# Altium schematic sheet LED_PCB.SchDoc
size A3
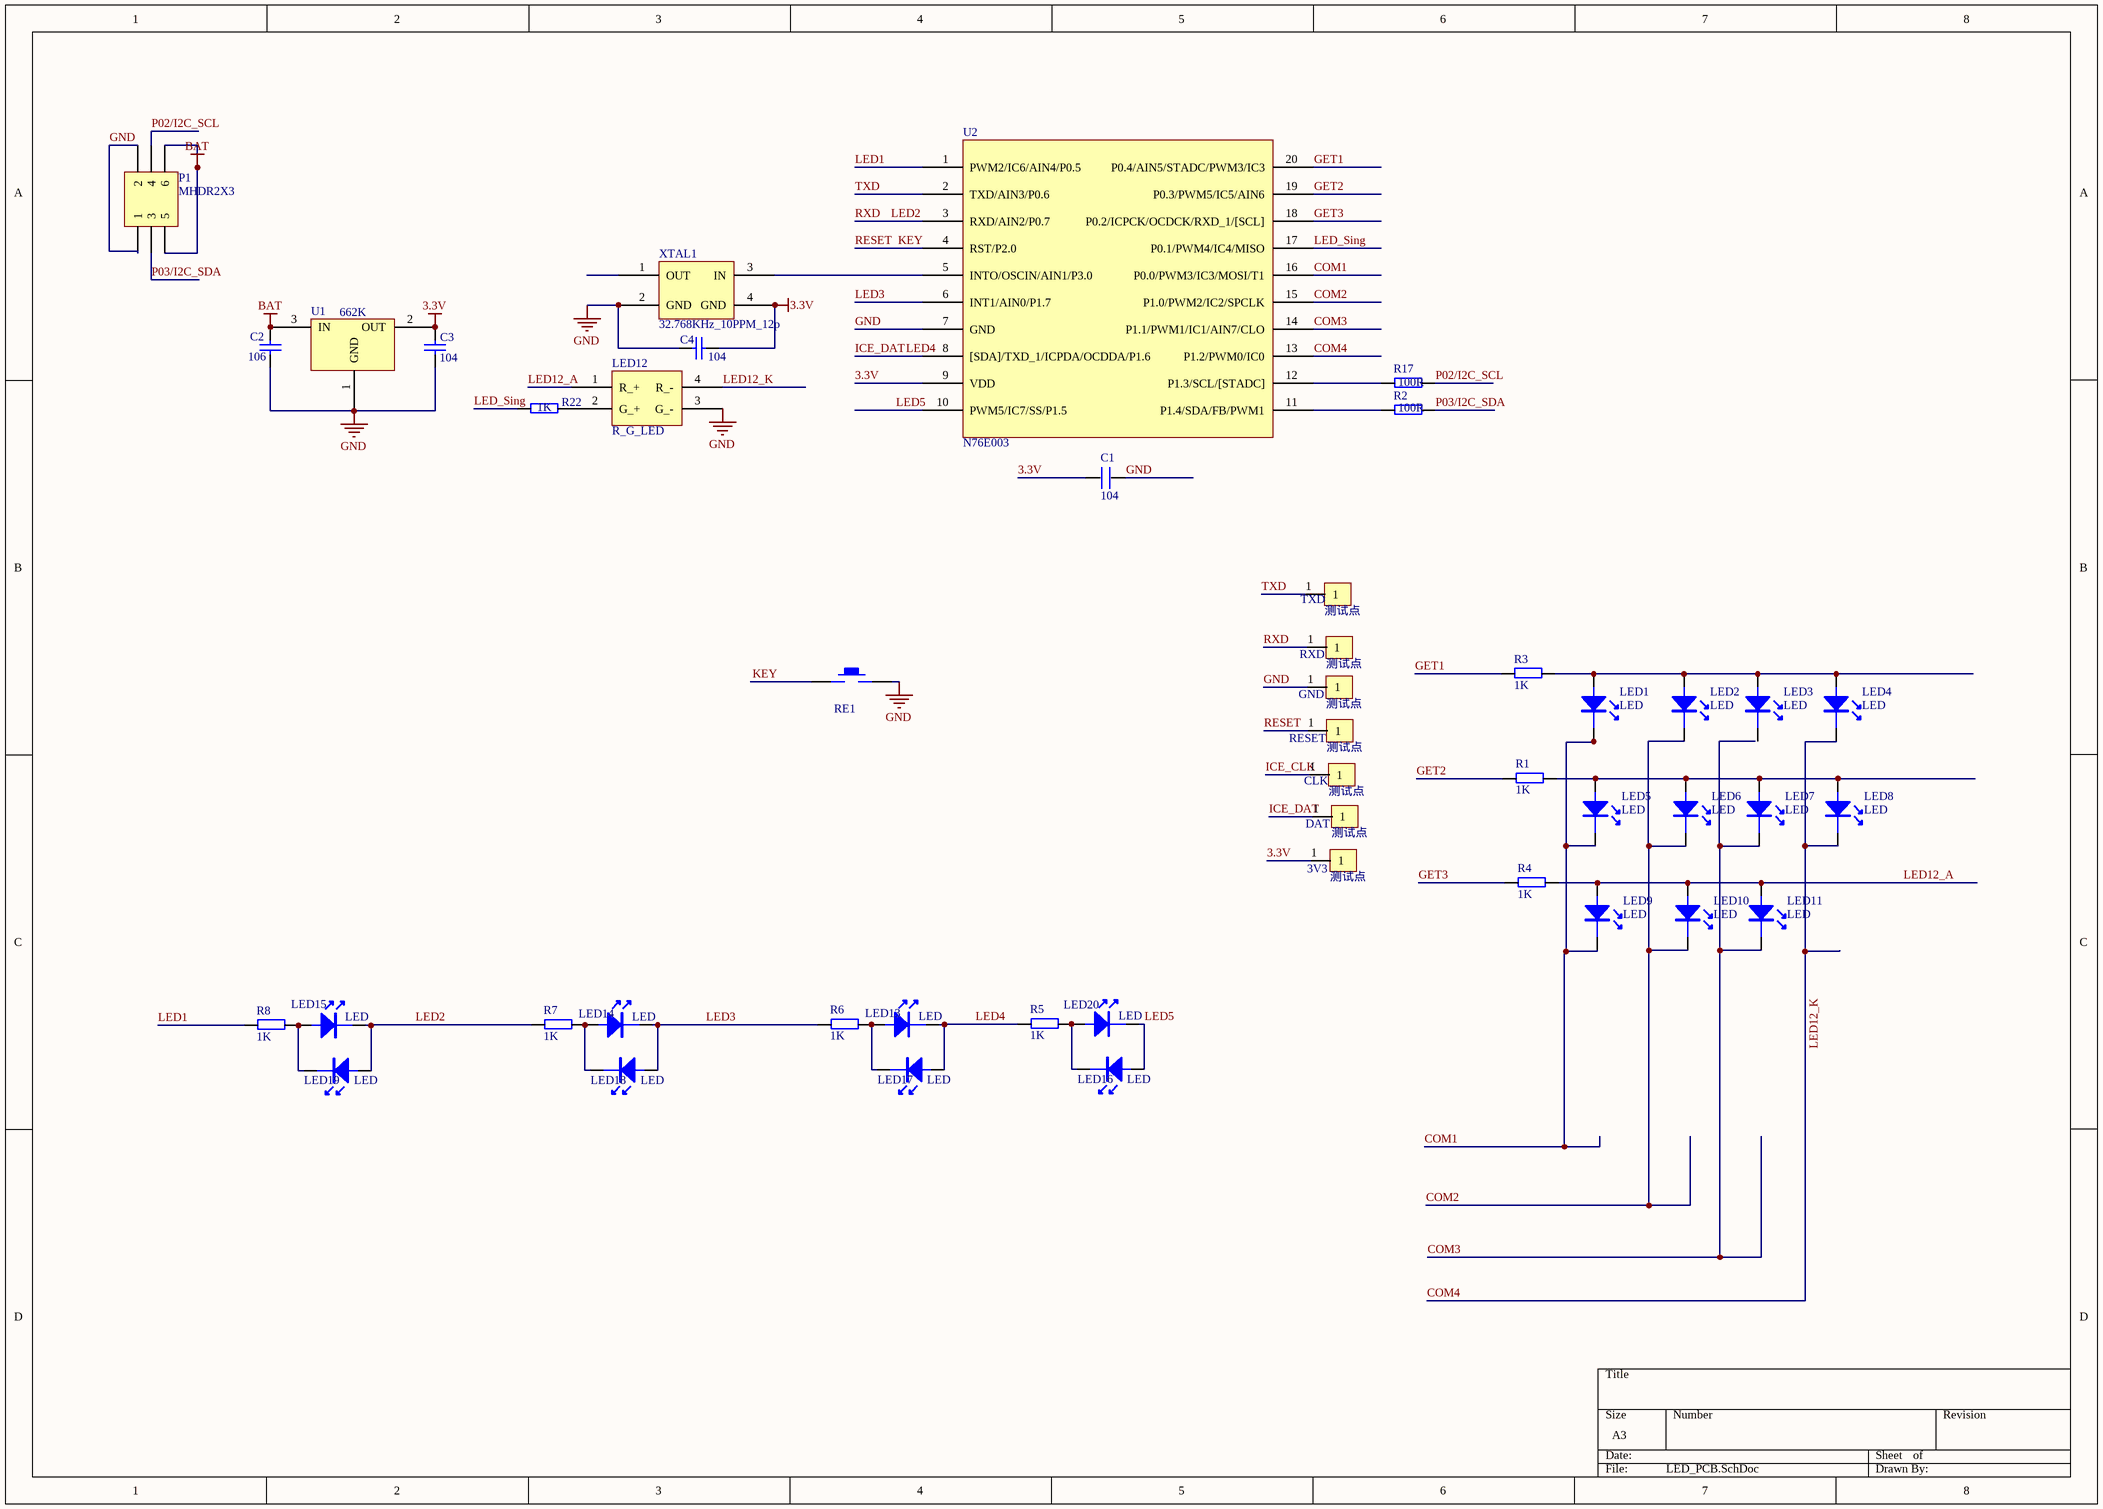
[diagram p0: LED_PCB.SchDoc]

## Parts
3V3  测试点  [测试点]
C1  104  [0603P]
C2  106  [0603P]
C3  104  [0603P]
C4  104  [0402_C]
CLK  测试点  [测试点]
DAT  测试点  [测试点]
GND  测试点  [测试点]
LED1  LED  [0402_LED]
LED2  LED  [0402_LED]
LED3  LED  [0402_LED]
LED4  LED  [0402_LED]
LED5  LED  [0402_LED]
LED6  LED  [0402_LED]
LED7  LED  [0402_LED]
LED8  LED  [0402_LED]
LED9  LED  [0402_LED]
LED10  LED  [0402_LED]
LED11  LED  [0402_LED]
LED12  R_G_LED  [0603_R_G_LED]
LED13  LED  [0402_LED]
LED14  LED  [0402_LED]
LED15  LED  [0402_LED]
LED16  LED  [0402_LED]
LED17  LED  [0402_LED]
LED18  LED  [0402_LED]
LED19  LED  [0402_LED]
LED20  LED  [0402_LED]
P1  MHDR2X3  [AXF_6A_G]
R1  1K  [0402_R]
R2  100R  [0402_R]
R3  1K  [0402_R]
R4  1K  [0402_R]
R5  1K  [0402_R]
R6  1K  [0402_R]
R7  1K  [0402_R]
R8  1K  [0402_R]
R17  100R  [0402_R]
R22  1K  [0402_R]
RE1  KEY_M  [轻触开关 2x4]  (value not drawn)
RESET  测试点  [测试点]
RXD  测试点  [测试点]
TXD  测试点  [测试点]
U1  662K  [SOT-23]
U2  N76E003  [STSOP20]
XTAL1  32.768KHz_10PPM_12p  [晶振2*2.6]

## Nets
3.3V: 3V3.1 C1.2 C3.2 C4.1 U1.2(OUT) U2.9(VDD) XTAL1.4(GND)
BAT: C2.2 P1.5 P1.6 U1.3(IN)
GND: C1.1 C2.1 C3.1 C4.2 GND.1 LED12.3(G_-) P1.1 P1.2 RE1.2 U1.1(GND) U2.7(GND) XTAL1.2(GND)
COM1: LED1.2(K) LED5.2(K) LED9.2(K) U2.16(P0.0/PWM3/IC3/MOSI/T1)
COM2: LED2.2(K) LED6.2(K) LED10.2(K) U2.15(P1.0/PWM2/IC2/SPCLK)
COM3: LED7.2(K) LED11.2(K) U2.14(P1.1/PWM1/IC1/AIN7/CLO)
COM4: LED4.2(K) LED8.2(K) LED12.4(R_-) U2.13(P1.2/PWM0/IC0)  [also labelled LED12_K]
GET1: R3.2 U2.20(P0.4/AIN5/STADC/PWM3/IC3)
GET2: R1.2 U2.19(P0.3/PWM5/IC5/AIN6)
GET3: R4.2 U2.18(P0.2/ICPCK/OCDCK/RXD_1/[SCL])
ICE_CLK: CLK.1
ICE_DAT: DAT.1 LED13.2(K) LED17.1(A) R5.2 U2.8([SDA]/TXD_1/ICPDA/OCDDA/P1.6)  [also labelled LED4]
KEY: RE1.1 RESET.1 U2.4(RST/P2.0)  [also labelled RESET]
LED1: R8.2 U2.1(PWM2/IC6/AIN4/P0.5)
LED2: LED15.2(K) LED19.1(A) R7.2 RXD.1 U2.3(RXD/AIN2/P0.7)  [also labelled RXD]
LED3: LED14.2(K) LED18.1(A) R6.2 U2.6(INT1/AIN0/P1.7)
LED5: LED16.1(A) LED20.2(K) U2.10(PWM5/IC7/SS/P1.5)
LED12_A: LED9.1(A) LED10.1(A) LED11.1(A) LED12.1(R_+) R4.1
LED_Sing: R22.2 U2.17(P0.1/PWM4/IC4/MISO)
P02/I2C_SCL: P1.4 R17.1
P03/I2C_SDA: P1.3 R2.1
TXD: TXD.1 U2.2(TXD/AIN3/P0.6)
NetLED1_1: LED1.1(A) LED2.1(A) LED3.1(A) LED4.1(A) R3.1
NetLED5_1: LED5.1(A) LED6.1(A) LED7.1(A) LED8.1(A) R1.1
NetLED12_2: LED12.2(G_+) R22.1
NetLED13_1: LED13.1(A) LED17.2(K) R6.1
NetLED14_1: LED14.1(A) LED18.2(K) R7.1
NetLED15_1: LED15.1(A) LED19.2(K) R8.1
NetLED16_2: LED16.2(K) LED20.1(A) R5.1
NetR2_2: R2.2 U2.11(P1.4/SDA/FB/PWM1)
NetR17_2: R17.2 U2.12(P1.3/SCL/[STADC])
NetU2_5: U2.5(INTO/OSCIN/AIN1/P3.0) XTAL1.3(IN)

Not connected (* = marked no-connect by the designer): LED3 2(K); XTAL1 1(OUT)

## Library data of the parts
C1 = C
C2-C4 = Cap: Capacitor; Value: 100pF; Published: 8-Jun-2000; LatestRevisionDate: 17-Jul-2002; LatestRevisionNote: Re-released for DXP Platform.; PackageReference: RAD-0.3; Publisher: Altium Limited
P1 = MHDR2X3: Header, 3-Pin, Dual row; LatestRevisionDate: 17-Jul-2002; LatestRevisionNote: Re-released for DXP Platform.; Publisher: Altium Limited
R1-R8 R17 R22 = R
XTAL1 = 晶振